# EAGLE schematic 3005_beacon_nordic (EAGLE 9.6.2)
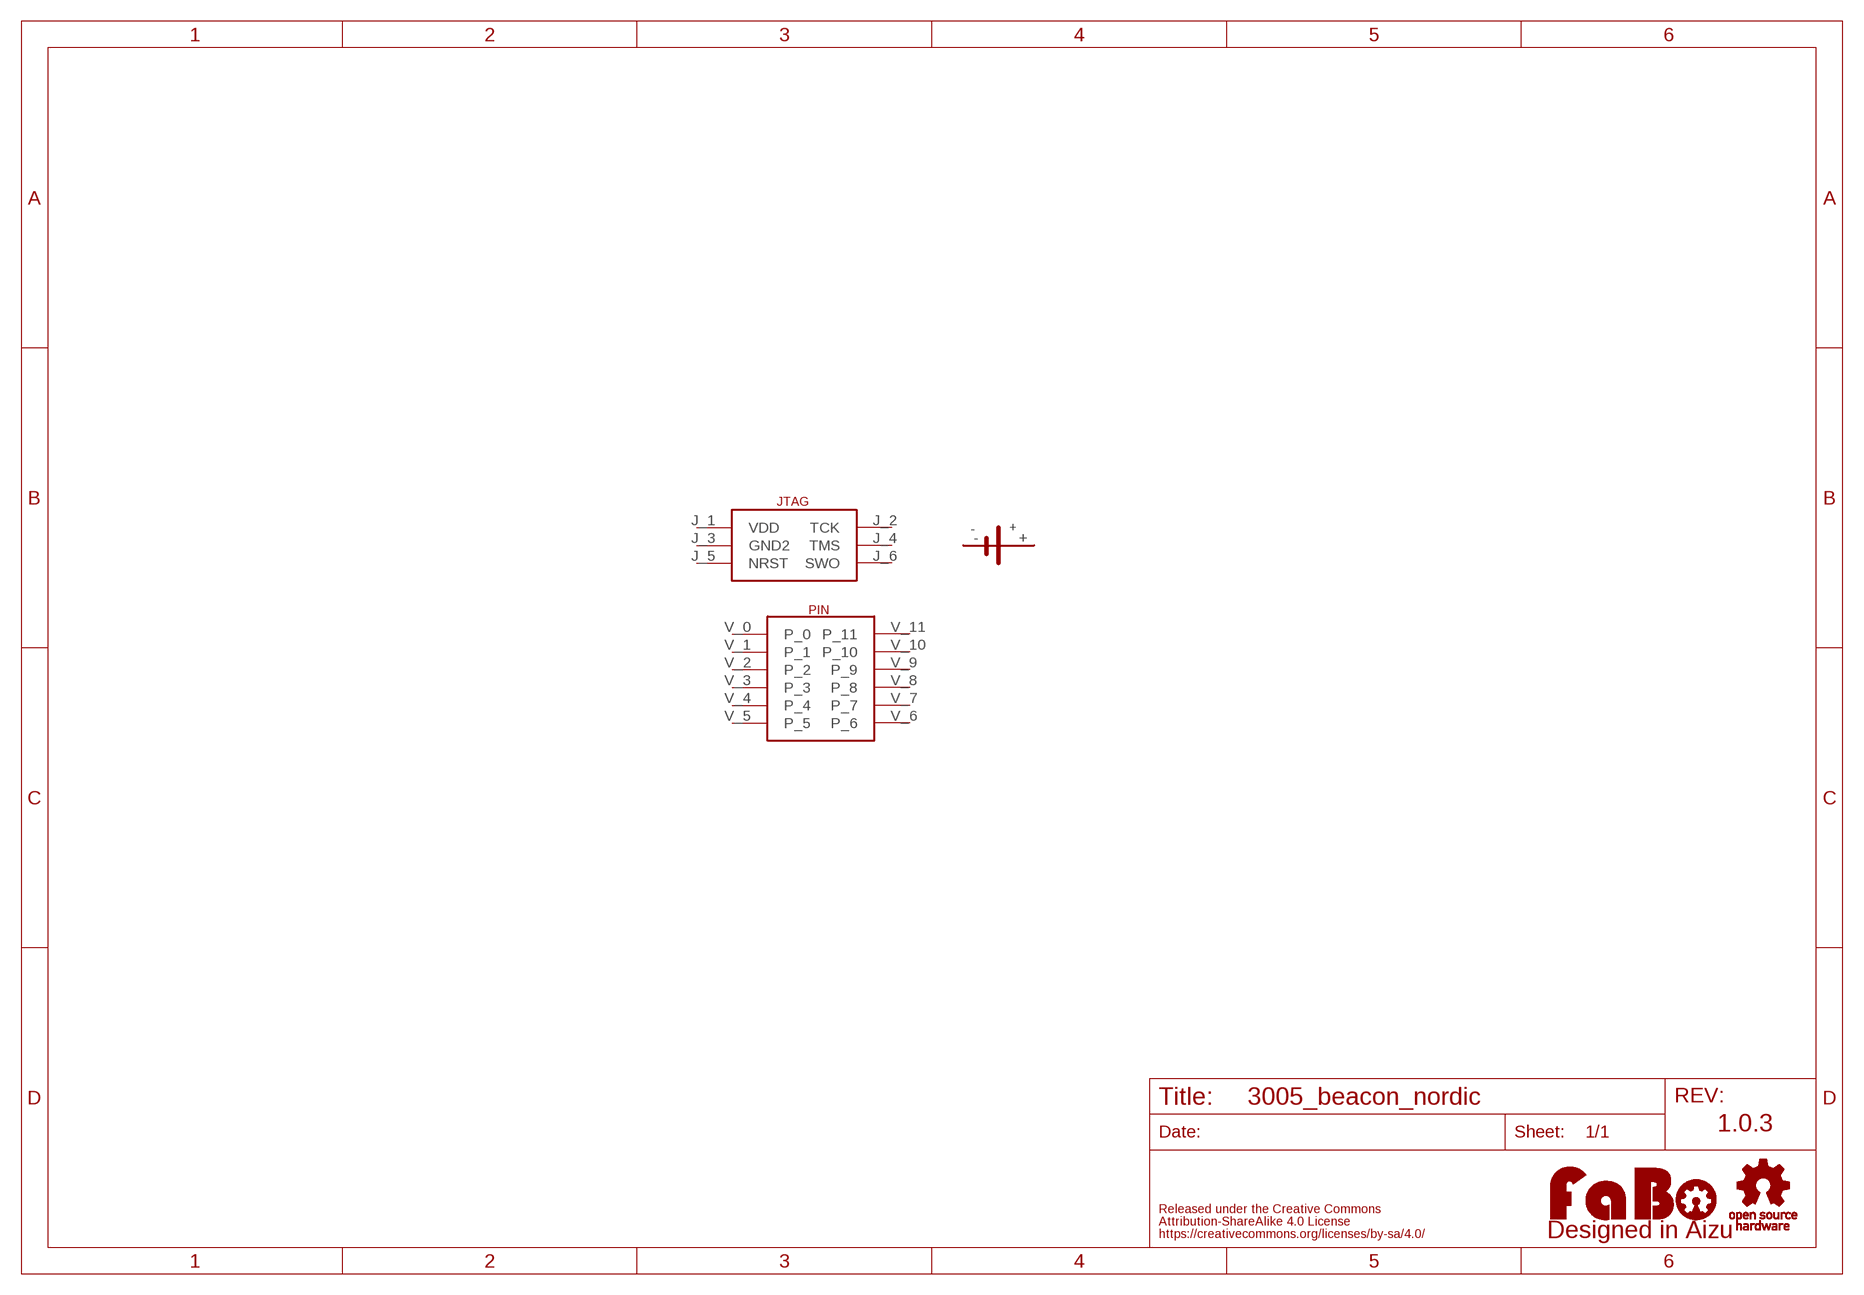
[diagram p0: schematic, sheet 1]

## Parts
PIN  FABO-BEACON  [FABO-BEACON]
U$2  LOGO_OSHW-M_BOTTOM  [LOGO_OSHW_M_BOTTOM]
U$3  LOGO_FABO-M  [LOGO_FABO_MS]
Unconnected: PIN.+(VCC) PIN.-(GND) PIN.J_1(VDD) PIN.J_2(TCK) PIN.J_3(GND2) PIN.J_4(TMS) PIN.J_5(NRST) PIN.J_6(SWO) PIN.V_0(P_0) PIN.V_1(P_1) PIN.V_2(P_2) PIN.V_3(P_3) PIN.V_4(P_4) PIN.V_5(P_5) PIN.V_6(P_6) PIN.V_7(P_7) PIN.V_8(P_8) PIN.V_9(P_9) PIN.V_10(P_10) PIN.V_11(P_11)

## Notes on the sheet
- 1.0.3

## Library data of the parts
PIN = FaBo-Template:FABO-BEACON
U$2 = FaBo-Logo:LOGO_OSHW
U$3 = FaBo-Logo:LOGO_FABO